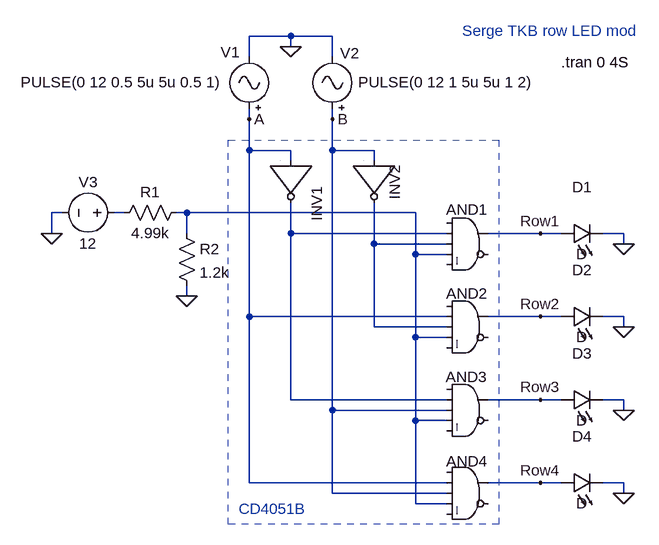
[diagram p0: schematic serge-tkb-leds-cd4051b.asc]
serge-tkb-leds-cd4051b.asc, the LTspice schematic file:
Version 4
SHEET 1 880 752
WIRE -32 -128 -96 -128
WIRE 32 -128 -32 -128
WIRE -32 -112 -32 -128
WIRE -96 -96 -96 -128
WIRE 32 -96 32 -128
WIRE -96 0 -96 -16
WIRE 32 0 32 -16
WIRE -96 48 -96 0
WIRE -32 48 -96 48
WIRE 32 48 32 0
WIRE 96 48 32 48
WIRE -32 64 -32 48
WIRE 96 64 96 48
WIRE -384 144 -400 144
WIRE -288 144 -304 144
WIRE -192 144 -208 144
WIRE 160 144 -192 144
WIRE -400 176 -400 144
WIRE -192 176 -192 144
WIRE -32 176 -32 128
WIRE 208 176 -32 176
WIRE 352 176 272 176
WIRE 384 176 352 176
WIRE 480 176 448 176
WIRE 96 192 96 128
WIRE 208 192 96 192
WIRE 480 192 480 176
WIRE 160 208 160 144
WIRE 208 208 160 208
WIRE -192 272 -192 256
WIRE -96 304 -96 48
WIRE 208 304 -96 304
WIRE 352 304 272 304
WIRE 384 304 352 304
WIRE 480 304 448 304
WIRE 96 320 96 192
WIRE 208 320 96 320
WIRE 480 320 480 304
WIRE 160 336 160 208
WIRE 208 336 160 336
WIRE -32 432 -32 176
WIRE 208 432 -32 432
WIRE 352 432 272 432
WIRE 384 432 352 432
WIRE 480 432 448 432
WIRE 32 448 32 48
WIRE 208 448 32 448
WIRE 480 448 480 432
WIRE 160 464 160 336
WIRE 208 464 160 464
WIRE -96 560 -96 304
WIRE 208 560 -96 560
WIRE 352 560 272 560
WIRE 384 560 352 560
WIRE 480 560 448 560
WIRE 32 576 32 448
WIRE 208 576 32 576
WIRE 480 576 480 560
WIRE 160 592 160 464
WIRE 208 592 160 592
FLAG -96 0 A
FLAG 32 0 B
FLAG 352 176 Row1
FLAG 352 304 Row2
FLAG 352 432 Row3
FLAG 352 560 Row4
FLAG 480 576 0
FLAG 480 448 0
FLAG 480 320 0
FLAG 480 192 0
FLAG -400 176 0
FLAG -32 -112 0
FLAG -192 272 0
SYMBOL LED 384 192 R270
WINDOW 0 72 32 VTop 2
WINDOW 3 0 32 VBottom 2
SYMATTR InstName D1
SYMBOL LED 384 320 R270
WINDOW 0 72 32 VTop 2
WINDOW 3 0 32 VBottom 2
SYMATTR InstName D2
SYMBOL LED 384 448 R270
WINDOW 0 72 32 VTop 2
WINDOW 3 0 32 VBottom 2
SYMATTR InstName D3
SYMBOL LED 384 576 R270
WINDOW 0 72 32 VTop 2
WINDOW 3 0 32 VBottom 2
SYMATTR InstName D4
SYMBOL Digital/inv 160 64 R90
WINDOW 0 7 32 Left 2
SYMATTR InstName INV2
SYMBOL Digital/and 240 128 R0
WINDOW 0 -33 11 Left 2
SYMATTR InstName AND1
SYMBOL Digital/and 240 256 R0
WINDOW 0 -33 12 Left 2
SYMATTR InstName AND2
SYMBOL Digital/and 240 384 R0
WINDOW 0 -34 13 Left 2
SYMATTR InstName AND3
SYMBOL Digital/and 240 512 R0
WINDOW 0 -33 15 Left 2
SYMATTR InstName AND4
SYMBOL Misc/signal 32 0 R180
WINDOW 0 -41 102 Left 2
WINDOW 3 -310 57 Left 2
SYMATTR InstName V2
SYMATTR Value PULSE(0 12 1 5u 5u 1 2)
SYMBOL Misc/signal -96 0 R180
WINDOW 0 15 103 Left 2
WINDOW 3 41 57 Left 2
SYMATTR InstName V1
SYMATTR Value PULSE(0 12 0.5 5u 5u 0.5 1)
SYMBOL Digital/inv 32 64 R90
SYMATTR InstName INV1
SYMBOL voltage -288 144 R90
WINDOW 0 -32 56 VBottom 2
WINDOW 3 32 56 VTop 2
SYMATTR InstName V3
SYMATTR Value 12
SYMBOL res -192 128 R90
WINDOW 0 0 56 VBottom 2
WINDOW 3 32 56 VTop 2
SYMATTR InstName R1
SYMATTR Value 4.99k
SYMBOL res -208 160 R0
SYMATTR InstName R2
SYMATTR Value 1.2k
TEXT 384 -88 Left 2 !.tran 0 4S
TEXT 232 -136 Left 2 ;Serge TKB row LED mod
TEXT -112 600 Left 2 ;CD4051B
LINE Normal -128 32 288 32 2
LINE Normal 288 32 288 624 2
LINE Normal 288 624 -128 624 2
LINE Normal -128 624 -128 32 2

The netlist it stands for:
* serge-tkb-leds-cd4051b.asc
D1 Row1 0 D
D2 Row2 0 D
D3 Row3 0 D
D4 Row4 0 D
A§INV2 B 0 0 0 0 N004 0 0 BUF
AND1 0 N003 N004 N002 0 0 Row1 0 AND
AND2 0 A N004 N002 0 0 Row2 0 AND
AND3 0 N003 B N002 0 0 Row3 0 AND
AND4 0 A B N002 0 0 Row4 0 AND
V2 B 0 PULSE(0 12 1 5u 5u 1 2)
V1 A 0 PULSE(0 12 0.5 5u 5u 0.5 1)
A§INV1 A 0 0 0 0 N003 0 0 BUF
V3 N001 0 12
R1 N002 N001 4.99k
R2 N002 0 1.2k
.model D D
.lib standard.dio
.tran 0 4S
* Serge TKB row LED mod
* CD4051B
.backanno
.end